# EAGLE design Adafruit INA260 (EAGLE 9.2.2)
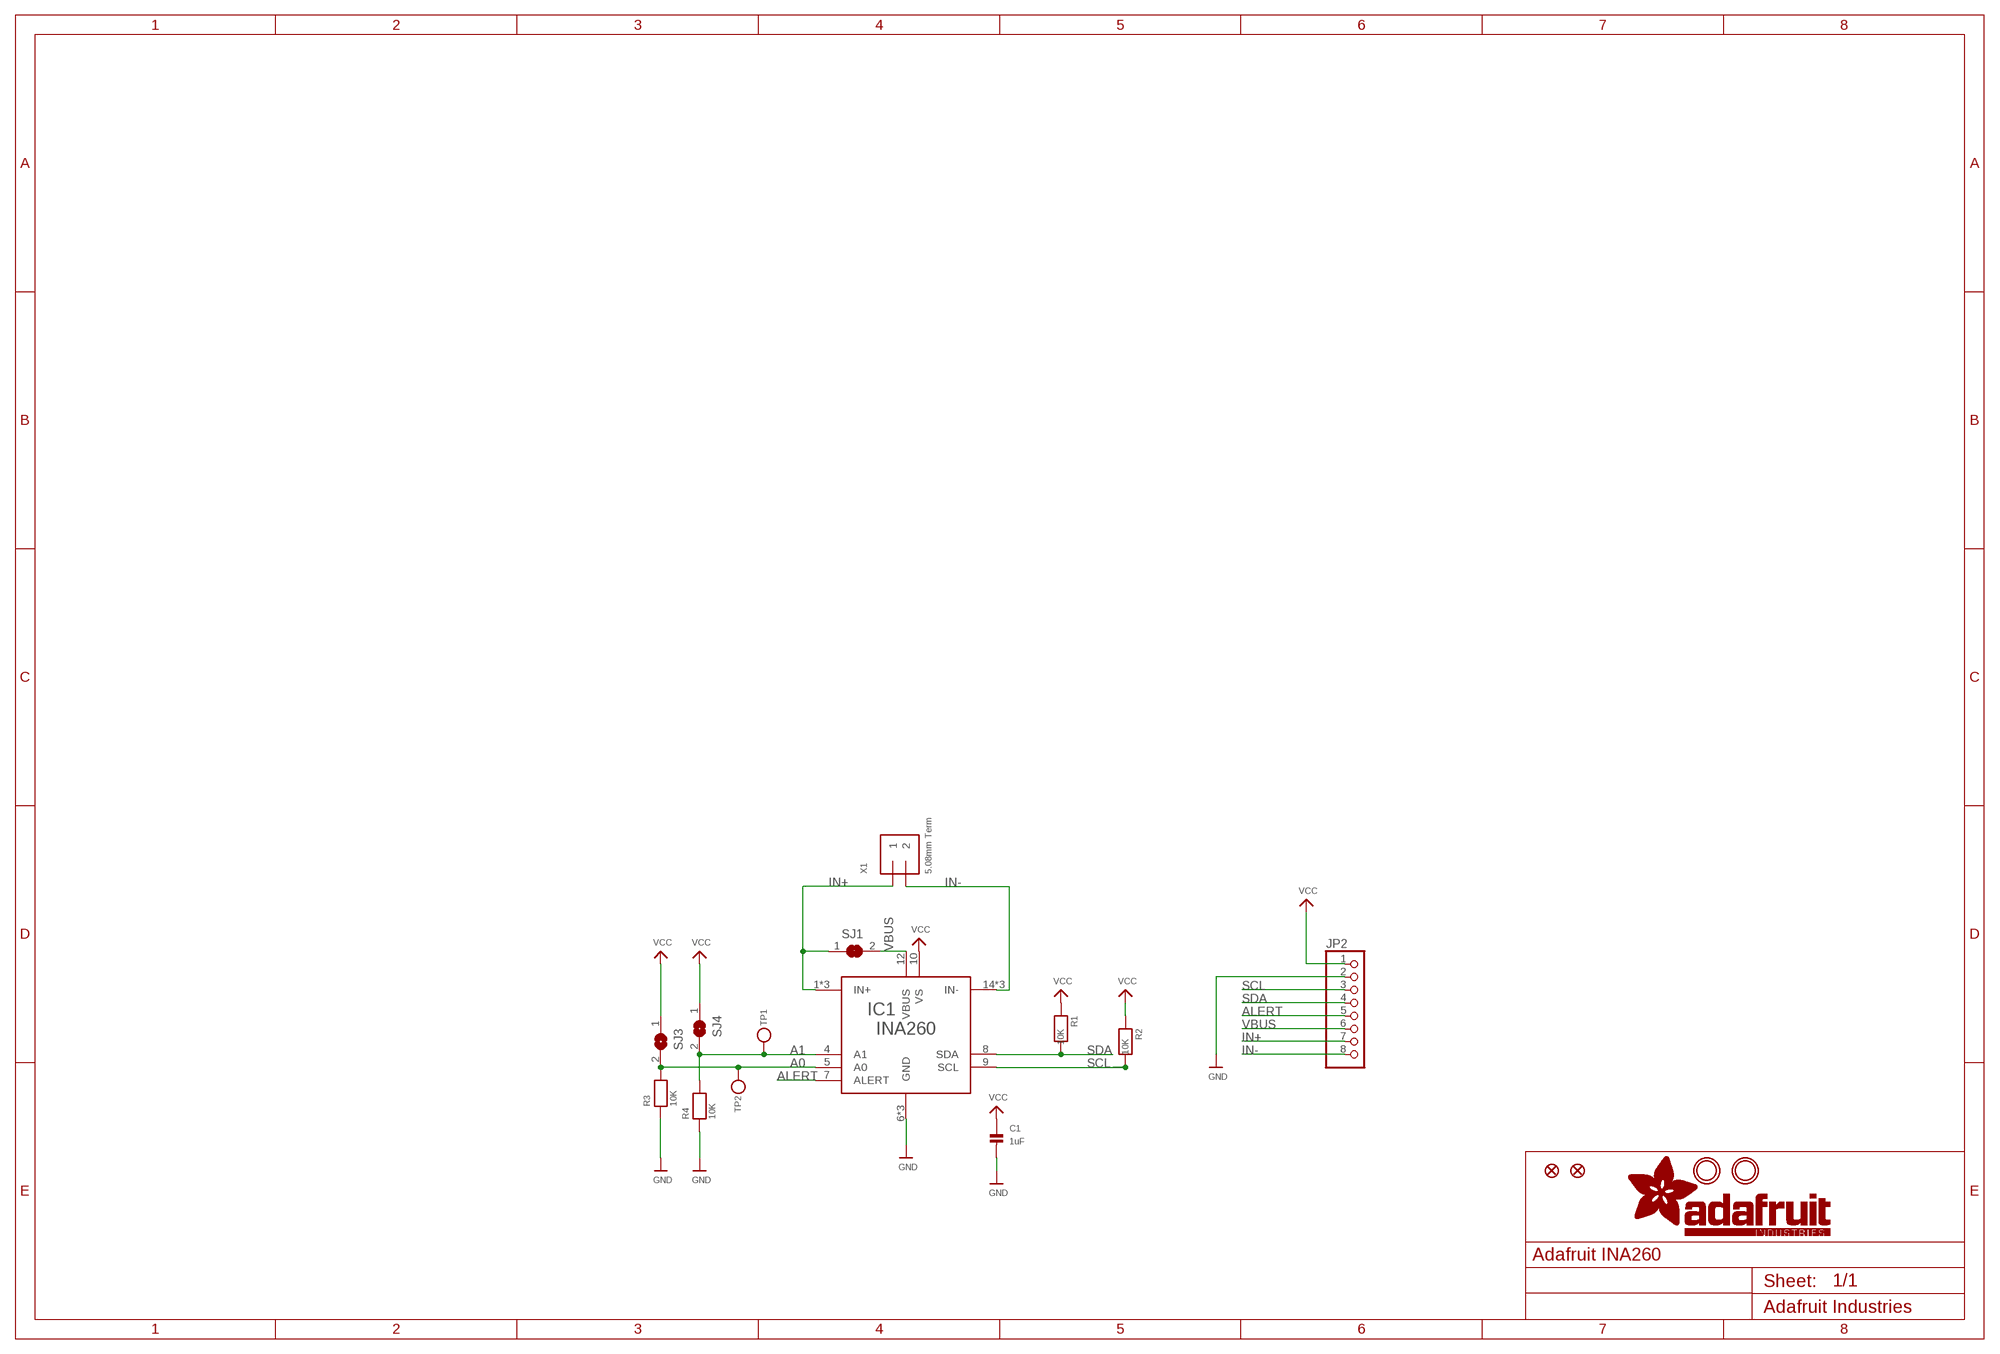
[diagram p0: schematic, sheet 1]

## Parts
C1  1uF  CAP_CERAMIC0603_NO  [0603-NO]
FID3  MICROBUILDER_FIDUCIAL""  [MICROBUILDER_FIDUCIAL_1MM]
FID4  MICROBUILDER_FIDUCIAL""  [MICROBUILDER_FIDUCIAL_1MM]
IC1  INA260  [TSSOP16]
JP2  HEADER-1X870MIL  [1X08_ROUND_70]
R1  10K  RESISTOR_0603_NOOUT  [0603-NO]
R2  10K  RESISTOR_0603_NOOUT  [0603-NO]
R3  10K  RESISTOR_0603_NOOUT  [0603-NO]
R4  10K  RESISTOR_0603_NOOUT  [0603-NO]
SJ1  SOLDERJUMPER_CLOSED  [SOLDERJUMPER_CLOSEDWIRE]
SJ3  SOLDERJUMPER  [SOLDERJUMPER_ARROW_NOPASTE]
SJ4  SOLDERJUMPER  [SOLDERJUMPER_ARROW_NOPASTE]
TP1  TESTPOINTROUND1.5MM  [TESTPOINT_ROUND_1.5MM]
TP2  TESTPOINTROUND1.5MM  [TESTPOINT_ROUND_1.5MM]
U$7  MOUNTINGHOLE2.5  [MOUNTINGHOLE_2.5_PLATED]
U$8  MOUNTINGHOLE2.5  [MOUNTINGHOLE_2.5_PLATED]
X1  5.08mm Term  TERMBLOCK_1X2_5.08MM  [TERMBLOCK_508_1X2]

## Nets
A0: IC1.5(A0) R3.2 SJ3.2 TP2.P$1
A1: IC1.4(A1) R4.2 SJ4.2 TP1.P$1
ALERT: IC1.7(ALERT) JP2.5
GND: C1.2 IC1.6(GND) IC1.11(GND) IC1.13(GND) JP2.2 R3.1 R4.1
IN+: IC1.1(IN+) IC1.2(IN+) IC1.3(IN+) JP2.7 SJ1.1 X1.P$3
IN-: IC1.14(IN-) IC1.15(IN-) IC1.16(IN-) JP2.8 X1.P$4
SCL: IC1.9(SCL) JP2.3 R2.2
SDA: IC1.8(SDA) JP2.4 R1.2
VBUS: IC1.12(VBUS) JP2.6 SJ1.2
VCC: C1.1 IC1.10(VS) JP2.1 R1.1 R2.1 SJ3.1 SJ4.1

## Library data of the parts
C1 = microbuilder:CAP_CERAMIC: Ceramic Capacitors For new designs, use the packages preceded by an '_' character since they are more reliable: The following footprints should be used on most boards: _0402 - Standard footprint for regular board layouts _0603 - Standard footprint for regular board layouts _0805 - Standard footprint for regular board layouts _1206 - Standard footprint for regular board layouts For extremely tight-pitch boards where space is at a premium, the following 'micro-pitch' footprints can be used (smaller pads, no silkscreen outline, etc.): _0402MP - Micro-pitch footprint for very dense/compact boards _0603MP - Micro-pitch footprint for very dense/compact boards _0805MP - Micro-pitch footprint for very dense/compact boards _1206MP - Micro-pitch footprint for very dense/compact boards
FID3 FID4 = Adafruit_INA219_CurPowerMonitor:MICROBUILDER_FIDUCIAL: Fiducial Alignment Points Various fiducial points for machine vision alignment.
IC1 = microbuilder:INA260
JP2 = microbuilder:HEADER-1X8: PIN HEADER
R1-R4 = microbuilder:RESISTOR: Resistors For new designs, use the packages preceded by an '_' character since they are more reliable: The following footprints should be used on most boards: _0402 - Standard footprint for regular board layouts _0603 - Standard footprint for regular board layouts _0805 - Standard footprint for regular board layouts _1206 - Standard footprint for regular board layouts For extremely tight-pitch boards where space is at a premium, the following 'micro-pitch' footprints can be used (smaller pads, no silkscreen outline, etc.): _0402MP - Micro-pitch footprint for very dense/compact boards _0603MP - Micro-pitch footprint for very dense/compact boards _0805MP - Micro-pitch footprint for very dense/compact boards _1206MP - Micro-pitch footprint for very dense/compact boards
SJ1 = microbuilder:SOLDERJUMPER_CLOSED: Solder Jumper - Closed These solder jumpers are closed by default CLOSEDWIRE - 10 mil trace between pads that can be cut and resoldered later CLOSEDPERM - 63 mil trace between pads for a permanent connection (used to 'bridge' two signals, a shameless hack for Eagle). Can double as a test point as well (no cream layer)
SJ3 SJ4 = microbuilder:SOLDERJUMPER: SMD Solder JUMPER Solder the two pads together to create a connection, or remove the solder to break it. REFLOW - Use this footprint for solder paste and reflow ovens. WAVE - Use this footprint for hand-soldering (larger pads). CLOSED - Has a trace between the two pads to ensure it is closed by default. The trace needs to be cut to disable the jumper, and can be closed again by creating a solder bridge between the two pads.; BOM: EXCLUDE
TP1 TP2 = microbuilder:TESTPOINT: Test Point Various test points for characterisation and PCB testing TESTPOINT_SMT - Compact Surface Mount Test Point [Digikey: 5016KTR-ND]
U$7 U$8 = microbuilder:MOUNTINGHOLE: Mounting Hole For #2 screws (0.086"/2.18mm width, 0.094"/2.4mm hole) use 2.5mm; BOM: EXCLUDE
X1 = microbuilder:TERMBLOCK_1X2: 3.5mm Terminal block http://www.ladyada.net/library/pcb/eaglelibrary.html

## Board
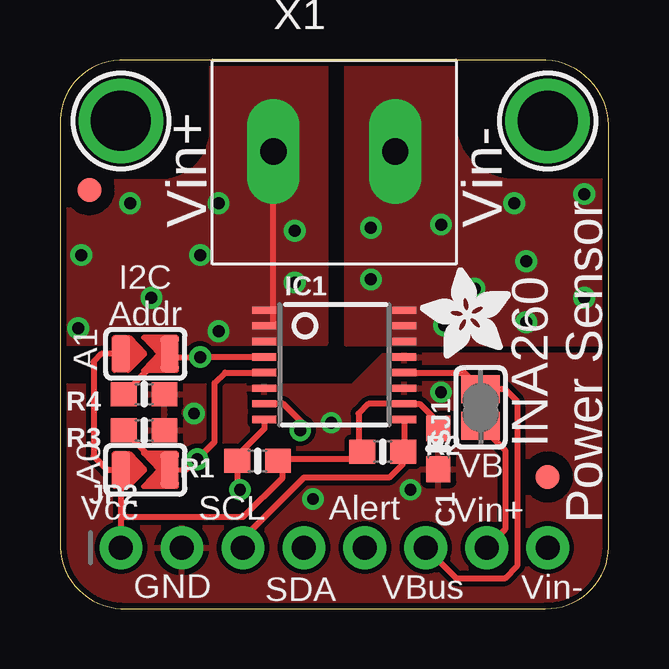
[diagram p1: board, top side]
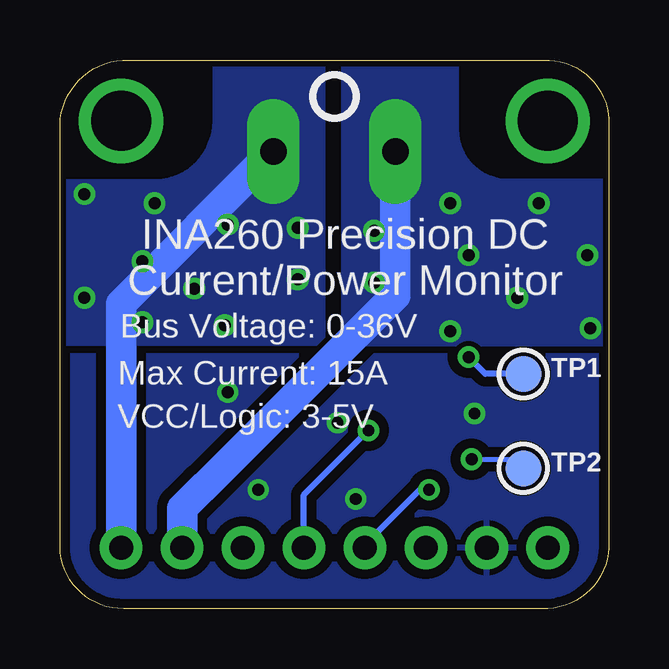
[diagram p2: board, bottom side, seen from below]

Size 22.86 x 22.86 mm. Coordinates in mm from the lower left corner, seen from the top.
Outline: 0,20.14 0,2.79 arc90 2.54,0 20.22,0 arc90 22.86,2.56 22.86,19.89 arc90 20.24,22.86 2.49,22.86 arc90 0,20.14
Copper layers (1*16): Top 0.035mm / dielectric 1.5mm / Bottom 0.035mm
Design rules "adafruit": minimum track width 8mil, minimum drill 15.5mil, track to track 8mil, track to pad 8mil, pad to pad 8mil, via to via 8mil, smd to smd 8mil, copper to edge 10mil, drill to drill 8mil, minimum pad ring 10mil, minimum via ring 8mil, stop-mask expansion 2mil, vias tented up to drill 20mil, thermal gap 10mil

### Footprints (pad centres in the part's own frame; a part is rotated, then mirrored left to right if it is on the bottom)
0603-NO = smd 1.075 x 1: 1 -0.85,0; 2 0.85,0
MICROBUILDER_FIDUCIAL_1MM = smd 1 x 1: 1 0,0
TSSOP16 = smd 0.305 x 0.991: 1 -2.275,-2.918; 2 -1.625,-2.918; 3 -0.975,-2.918; 4 -0.325,-2.918; 5 0.325,-2.918; 6 0.975,-2.918; 7 1.625,-2.918; 8 2.275,-2.918; 9 2.275,2.918; 10 1.625,2.918; 11 0.975,2.918; 12 0.325,2.918; 13 -0.325,2.918; 14 -0.975,2.918; 15 -1.625,2.918; 16 -2.275,2.918
1X08_ROUND_70 = drill 1 pad 1.778: 1 -8.89,0; 2 -6.35,0; 3 -3.81,0; 4 -1.27,0; 5 1.27,0; 6 3.81,0; 7 6.35,0; 8 8.89,0
SOLDERJUMPER_CLOSEDWIRE = smd 1.168 x 1.6: 1 -0.762,0; 2 0.762,0 | smd 0.635 x 0.203: WIRE 0,0
SOLDERJUMPER_ARROW_NOPASTE = smd 0.762 x 1.524: 1 -1.016,0; 2 1.016,0
TESTPOINT_ROUND_1.5MM = smd 1.5 x 1.5: P$1 0,0
MOUNTINGHOLE_2.5_PLATED = drill 2.5 pad 3.2: P$1 0,0
TERMBLOCK_508_1X2 = drill 1.1 pad 2.184 long: P$3 -2.54,0; P$4 2.54,0

### Placement (x,y rotation side)
C1  15.76,6.65 270 top
FID3  20.32,5.49 0 top
FID4  1.22,17.45 0 top
IC1  11.43,10.16 270 top
JP2  11.43,2.54 0 top
R1  8.23,6.15 180 top
R2  13.45,6.53 0 top
R3  3.5,7.42 180 top
R4  3.5,8.94 180 top
SJ1  17.53,8.38 90 top
SJ3  3.56,5.79 0 top
SJ4  3.56,10.62 0 top
TP1  3.56,9.78 0 bottom
TP2  3.56,5.84 0 bottom
U$1  [ADAFRUIT_3.5MM]  18.8,10.41 90 top
U$6  [PCBFEAT-REV-040]  11.43,21.34 0 bottom
U$7  20.32,20.32 0 top
U$8  2.54,20.32 0 top
X1  11.43,19.05 0 top

### Tracks (layer width: path | path; a pad name or v marks a point on that pad's centre or on a via)
A0  (via drill 0.5)
  Top 0.203: SJ3.2 5.28,5.79 v5.72,6.22
  Top 0.254: 6.88,9.84 6.43,9.39 6.43,6.94 v5.72,6.22 | R3.2 4.29,5.79 SJ3.2 | 6.88,9.84 | 6.88,9.84 IC1.5
  Bottom 0.203: v5.72,6.22 3.94,6.22 TP2.P$1
A1  (via drill 0.5)
  Top 0.254: IC1.4 v5.84,10.48 4.7,10.48 SJ4.2 4.33,10.62 4.33,10.55 3.94,10.16 3.87,10.16 R4.2
  Bottom 0.254: TP1.P$1 5.14,9.78 v5.84,10.48
ALERT  (via drill 0.48)
  Top 0.254: v10.01,7.43 10.03,7.45 10.03,7.8 9.3,8.54 IC1.7
  Bottom 0.254: JP2.5 12.7,4.74 v10.01,7.43
GND  (via drill 0.48)
  other vias: 5.59,8.13 10.54,4.57 14.61,4.95 11.3,7.75 15.88,9.02
  pour Top: 13.51,10.57 22.73,10.57 22.86,0 0,0 0,9.27 12.22,9.27
  pour Bottom (isolate 0.406): 0,10.52 22.86,10.52 22.86,0 0,0
IN+  (via drill 0.5)
  Top 0.254: 8.89,11.94 X1.P$3 | SJ1.1 18.54,6.6 18.54,3.3 JP2.7
  Bottom 1.27: JP2.7 17.78,4.19 16.9,5.07 16.87,5.07 8.89,13.04 X1.P$3
  other vias: 0.76,11.68 6.6,11.56 5.84,14.73 9.78,15.75 9.78,13.59 0.89,14.73 2.92,16.89 6.6,16.89 3.81,12.95
  pour Top (no thermals): 11.05,11.05 0,11.05 0,17.78 4.19,17.78 arc90 6.35,19.94 6.35,22.86 11.05,22.86
  pour Bottom (no thermals): 11.05,11.05 0,11.05 0,17.78 4.19,17.78 arc90 6.35,19.94 6.35,22.86 11.05,22.86
IN-  (via drill 0.5)
  Bottom 1.27: JP2.8 20.32,12.7 X1.P$4
  other vias: 21.84,17.27 21.84,12.95 19.43,14.48 19.43,11.94 18.92,16.89 17.27,13.34 15.88,16 12.95,15.88 16,11.81 12.95,13.72
  pour Top (no thermals): 11.94,22.86 11.94,11.05 22.73,11.05 22.73,17.78 18.92,17.78 arc-90 16.38,20.32 16.38,22.86
  pour Bottom (no thermals): 11.94,22.86 11.94,11.05 22.73,11.05 22.73,17.78 18.92,17.78 arc-90 16.38,20.32 16.38,22.86
SCL
  Top 0.254: IC1.9 14.35,6.58 R2.2 14.3,6.04 13.72,5.46 10.16,5.46 7.62,2.92 JP2.3
SDA  (via drill 0.48)
  Top 0.254: v7.49,4.95 7.38,5.07 R1.2 7.38,6.36 8.51,7.5 IC1.8
  Bottom 0.254: v7.49,4.95 7.51,4.97 7.86,4.97 10.16,2.67 JP2.4
VBUS
  Top 0.254: IC1.12 16.84,9.84 SJ1.2 18.54,9.14 19.05,8.64 19.05,1.78 18.54,1.27 16.51,1.27 JP2.6
VCC
  Top 0.254: SJ4.1 1.73,10.62 1.4,10.29 1.4,6.35 1.96,5.79 SJ3.1 2.54,3.81 | 2.54,3.81 JP2.1 | 2.54,3.81 7.62,3.81 9.27,5.46 9.27,5.96 R1.1 9.15,6.22 12.29,6.22 R2.1 12.45,6.53 12.45,8.13 12.85,8.54 IC1.10 14.99,8.54 15.76,7.76 C1.1

### Text on the board
tPlace: Vin+ | Vin- | I2C / Addr | A1 | INA260 / Power Sensor | VB | A0 | Vcc | SCL | Alert | Vin+ | GND | SDA | VBus | Vin-
bPlace: INA260 Precision DC / Current/Power Monitor | Bus Voltage: 0-36V | Max Current: 15A | VCC/Logic: 3-5V